# Altium project OpenCore_Carrier_Board.PrjPcb (part 2 of 2)

## Sheet S08_DisplayPort.SchDoc: DisplayPort
size 381 x 241 mm; SheetNumber: 8; SheetTotal: 12
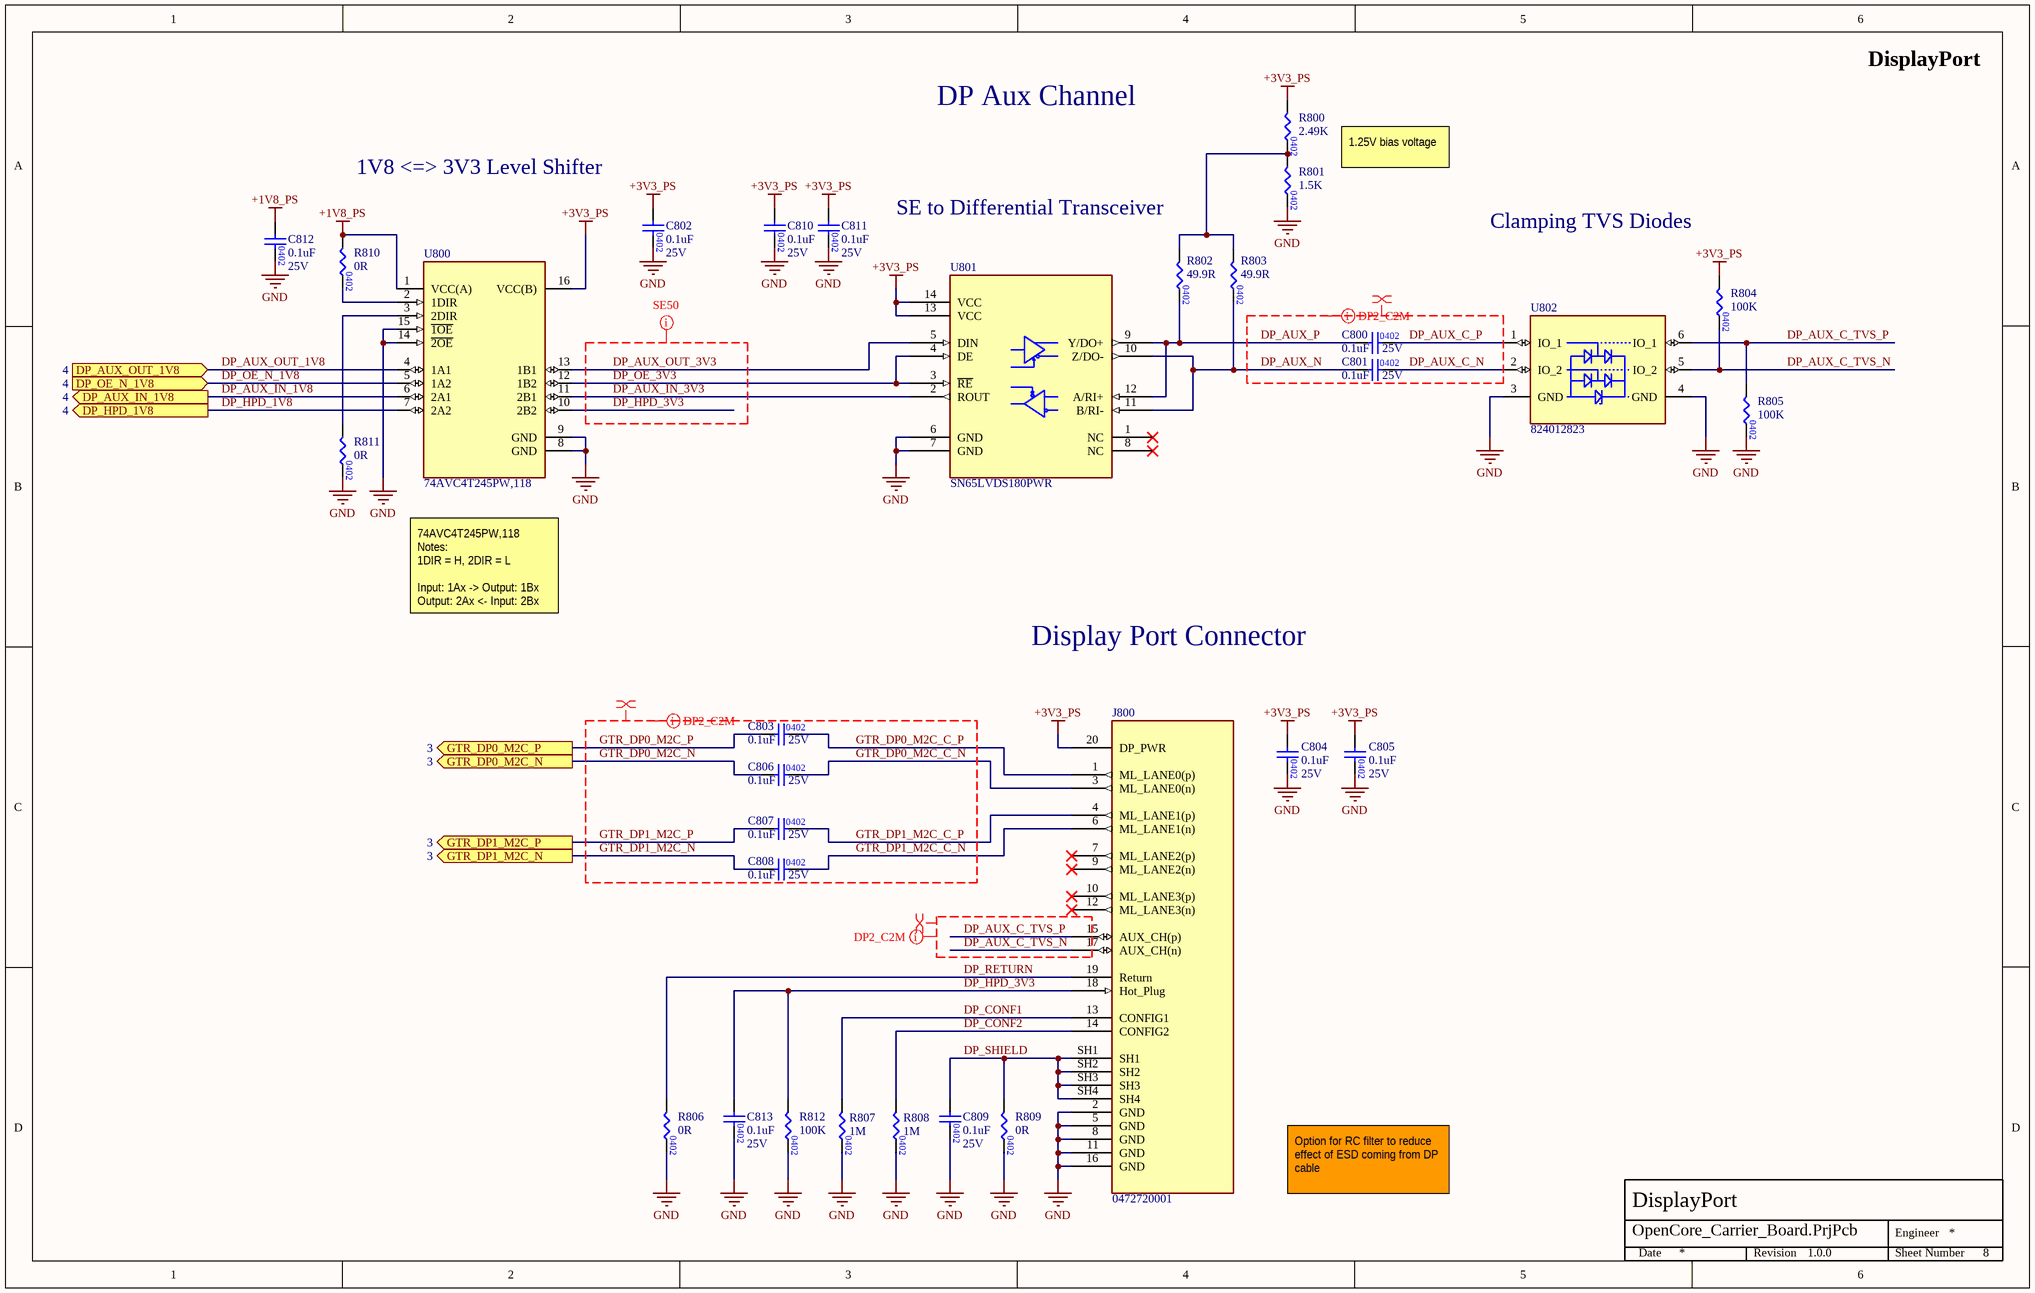
[diagram p7: S08_DisplayPort.SchDoc]

### Parts
C800  value 0.1uF  Voltage Rating: 25V  [CAP0402]  (hidden comment: CAP_0402)
C801  value 0.1uF  Voltage Rating: 25V  [CAP0402]  (hidden comment: CAP_0402)
C802  value 0.1uF  Voltage Rating: 25V  [CAP0402]  (hidden comment: CAP_0402)
C803  value 0.1uF  Voltage Rating: 25V  [CAP0402]  (hidden comment: CAP_0402)
C804  value 0.1uF  Voltage Rating: 25V  [CAP0402]  (hidden comment: CAP_0402)
C805  value 0.1uF  Voltage Rating: 25V  [CAP0402]  (hidden comment: CAP_0402)
C806  value 0.1uF  Voltage Rating: 25V  [CAP0402]  (hidden comment: CAP_0402)
C807  value 0.1uF  Voltage Rating: 25V  [CAP0402]  (hidden comment: CAP_0402)
C808  value 0.1uF  Voltage Rating: 25V  [CAP0402]  (hidden comment: CAP_0402)
C809  value 0.1uF  Voltage Rating: 25V  [CAP0402]  (hidden comment: CAP_0402)
C810  value 0.1uF  Voltage Rating: 25V  [CAP0402]  (hidden comment: CAP_0402)
C811  value 0.1uF  Voltage Rating: 25V  [CAP0402]  (hidden comment: CAP_0402)
C812  value 0.1uF  Voltage Rating: 25V  [CAP0402]  (hidden comment: CAP_0402)
C813  value 0.1uF  Voltage Rating: 25V  [CAP0402]  (hidden comment: CAP_0402)
J800  0472720001  [0472720001]
R800  Resistance: 2.49K  [RES0402]  (hidden comment: RES_0402)
R801  Resistance: 1.5K  [RES0402]  (hidden comment: RES_0402)
R802  Resistance: 49.9R  [RES0402]  (hidden comment: RES_0402)
R803  Resistance: 49.9R  [RES0402]  (hidden comment: RES_0402)
R804  Resistance: 100K  [RES0402]  (hidden comment: RES_0402)
R805  Resistance: 100K  [RES0402]  (hidden comment: RES_0402)
R806  Resistance: 0R  [RES0402]  (hidden comment: RES_0402)
R807  Resistance: 1M  [RES0402]  (hidden comment: RES_0402)
R808  Resistance: 1M  [RES0402]  (hidden comment: RES_0402)
R809  Resistance: 0R  [RES0402]  (hidden comment: RES_0402)
R810  Resistance: 0R  [RES0402]  (hidden comment: RES_0402)
R811  Resistance: 0R  [RES0402]  (hidden comment: RES_0402)
R812  Resistance: 100K  [RES0402]  (hidden comment: RES_0402)
U800  74AVC4T245PW,118  [SOP65P640X110-16N]
U801  SN65LVDS180PWR  [TI_TSSOP14_PW]
U802  824012823  [824012823]

### Ports
DP_AUX_IN_1V8 (out, see 4), DP_AUX_OUT_1V8 (in, see 4), DP_HPD_1V8 (out, see 4), DP_OE_N_1V8 (in, see 4), GTR_DP0_M2C_N (out, see 3), GTR_DP0_M2C_P (out, see 3), GTR_DP1_M2C_N (out, see 3), GTR_DP1_M2C_P (out, see 3)

### Nets
+1V8_PS: C812.1 R810.1 U800.1(VCC(A))
+3V3_PS: C802.1 C804.1 C805.1 C810.1 C811.1 J800.20(DP_PWR) R800.1 R804.1 U800.16(VCC(B)) U801.13(VCC) U801.14(VCC)
GND: C802.2 C804.2 C805.2 C809.2 C810.2 C811.2 C812.2 C813.2 J800.2(GND) J800.5(GND) J800.8(GND) J800.11(GND) J800.16(GND) R801.2 R805.2 R806.2 R807.2 R808.2 R809.2 R811.2 R812.2 U800.8(GND) U800.9(GND) U800.14(~{2OE}) U800.15(~{1OE}) U801.6(GND) U801.7(GND) U802.3(GND) U802.4(GND)
DP_AUX_C_N: C801.2 U802.2(IO_2)
DP_AUX_C_P: C800.2 U802.1(IO_1)
DP_AUX_C_TVS_N: J800.17(AUX_CH(n)) R804.2 U802.5(IO_2)
DP_AUX_C_TVS_P: J800.15(AUX_CH(p)) R805.1 U802.6(IO_1)
DP_AUX_IN_1V8: U800.6(2A1) ; port DP_AUX_IN_1V8
DP_AUX_IN_3V3: U800.11(2B1) U801.2(ROUT)
DP_AUX_N: C801.1 R803.2 U801.10(Z/DO-) U801.11(B/RI-)
DP_AUX_OUT_1V8: U800.4(1A1) ; port DP_AUX_OUT_1V8
DP_AUX_OUT_3V3: U800.13(1B1) U801.5(DIN)
DP_AUX_P: C800.1 R802.2 U801.9(Y/DO+) U801.12(A/RI+)
DP_CONF1: J800.13(CONFIG1) R807.1
DP_CONF2: J800.14(CONFIG2) R808.1
DP_HPD_1V8: U800.7(2A2) ; port DP_HPD_1V8
DP_HPD_3V3: C813.1 J800.18(Hot_Plug) R812.1 U800.10(2B2)
DP_OE_3V3: U800.12(1B2) U801.3(~{RE}) U801.4(DE)
DP_OE_N_1V8: U800.5(1A2) ; port DP_OE_N_1V8
DP_RETURN: J800.19(Return) R806.1
DP_SHIELD: C809.1 J800.SH1 J800.SH2 J800.SH3 J800.SH4 R809.1
GTR_DP0_M2C_C_N: C806.2 J800.3(ML_LANE0(n))
GTR_DP0_M2C_C_P: C803.2 J800.1(ML_LANE0(p))
GTR_DP0_M2C_N: C806.1 ; port GTR_DP0_M2C_N
GTR_DP0_M2C_P: C803.1 ; port GTR_DP0_M2C_P
GTR_DP1_M2C_C_N: C808.2 J800.6(ML_LANE1(n))
GTR_DP1_M2C_C_P: C807.2 J800.4(ML_LANE1(p))
GTR_DP1_M2C_N: C808.1 ; port GTR_DP1_M2C_N
GTR_DP1_M2C_P: C807.1 ; port GTR_DP1_M2C_P
NetR800_2: R800.2 R801.1 R802.1 R803.1
NetR810_2: R810.2 U800.2(1DIR)
NetR811_1: R811.1 U800.3(2DIR)

Not connected (* = marked no-connect by the designer): J800 7(ML_LANE2(p))* 9(ML_LANE2(n))* 10(ML_LANE3(p))* 12(ML_LANE3(n))*; U801 1(NC)* 8(NC)*

### Layout directives
differential pair; differential pair class DIFFPAIR90: DP_AUX_C_N, DP_AUX_C_P, DP_AUX_C_TVS_N, DP_AUX_C_TVS_P, DP_AUX_N, DP_AUX_P, GTR_DP0_M2C_C_N, GTR_DP0_M2C_C_P, GTR_DP0_M2C_N, GTR_DP0_M2C_P, GTR_DP1_M2C_C_N, GTR_DP1_M2C_C_P, GTR_DP1_M2C_N, GTR_DP1_M2C_P
net class DIFFPAIR_DP: DP_AUX_C_N, DP_AUX_C_P, DP_AUX_C_TVS_N, DP_AUX_C_TVS_P, DP_AUX_N, DP_AUX_P, GTR_DP0_M2C_C_N, GTR_DP0_M2C_C_P, GTR_DP0_M2C_N, GTR_DP0_M2C_P, GTR_DP1_M2C_C_N, GTR_DP1_M2C_C_P, GTR_DP1_M2C_N, GTR_DP1_M2C_P
net class SE50: DP_AUX_IN_3V3, DP_AUX_OUT_3V3, DP_HPD_3V3, DP_OE_3V3

### Notes on the sheet
- DP Aux Channel
- 1.25V bias voltage
- 1V8 <=> 3V3 Level Shifter
- SE to Differential Transceiver
- Clamping TVS Diodes
- 74AVC4T245PW,118 Notes:
  1DIR = H, 2DIR = L
  Input: 1Ax -> Output: 1Bx
  Output: 2Ax <- Input: 2Bx
- Display Port Connector
- Option for RC filter to reduce effect of ESD coming from DP cable
- Engineer
- Date
- Revision
- Sheet Number

### Library data of the parts
C800-C813 = CAP_CL05A104KA5NNNC: as C200 on sheet S02_Power_Converters; Manufacturer Part Number 1: CL05A104KA5NNNC; Case/Package: 0402; Mounting Type: Surface Mount; Temperature Coefficient: X5R
J800 = 0472720001: CONN RCPT DISPLAYPORT 20P SMD RA; Manufacturer_Name: Molex; Datasheet Link: http://www.molex.com/pdm_docs/sd/472720001_sd.pdf; Height: 6.9mm; Manufacturer_Part_Number: 0472720001; Mouser Part Number: N/A; Mouser Price/Stock: https://www.mouser.co.uk/ProductDetail/Molex/0472720001?qs=PBcRNPEHKsrarbeLf7n8sg%3D%3D; Arrow Part Number: 0472720001; Arrow Price/Stock: https://www.arrow.com/en/products/0472720001/molex?region=europe
R800 = .RES_RC0402FR-072K49L: RES 2.49K OHM 1% 1/16W 0402; Manufacturer: YAGEO; Manufacturer Part Number: RC0402FR-072K49L; Case/Package: 0402; Tolerance: 1%
R801 = .RES_RC0402FR-071K5L: RES 1.5K OHM 1% 1/16W 0402; Manufacturer: YAGEO; Manufacturer Part Number: RC0402FR-071K5L; Case/Package: 0402; Tolerance: 1%
R802 R803 = .RES_RC0402FR-0749R9L: RES 49.9 OHM 1% 1/16W 0402; Manufacturer: YAGEO; Manufacturer Part Number: RC0402FR-0749R9L; Case/Package: 0402; Tolerance: 1%
R804 R805 R812 = .RES_RC0402FR-07100KL: RES 100K OHM 1% 1/16W 0402; Manufacturer: YAGEO; Manufacturer Part Number: RC0402FR-07100KL; Case/Package: 0402; Tolerance: 1%
R806 R809-R811 = .RES_RC0402JR-070RL: as R201 on sheet S02_Power_Converters; Manufacturer Part Number: RC0402JR-070RL; Case/Package: 0402
R807 R808 = .RES_RC0402FR-071ML: RES 1M OHM 1% 1/16W 0402; Manufacturer: YAGEO; Manufacturer Part Number: RC0402FR-071ML; Case/Package: 0402; Tolerance: 1%
U800 = 74AVC4T245PW,118: IC TRANSLATION TXRX 3.6V 16TSSOP; Manufacturer_Name: Nexperia; Datasheet Link: https://assets.nexperia.com/documents/data-sheet/74AVC4T245.pdf; Height: 1.1mm; Manufacturer_Part_Number: 74AVC4T245PW,118; Mouser Part Number: 771-74AVC4T245PW118; Mouser Price/Stock: https://www.mouser.co.uk/ProductDetail/Nexperia/74AVC4T245PW118?qs=Lc7Es0%252BIaGKdmOKZhQIwZQ%3D%3D; Arrow Part Number: 74AVC4T245PW,118; Arrow Price/Stock: https://www.arrow.com/en/products/74avc4t245pw118/nexperia?region=nac; Supplier 1: Digi-Key; Supplier Part Number 1: 1727-6573-6-ND
U801 = SN65LVDS180PWR: IC TRANSCEIVER FULL 1/1 14TSSOP; Manufacturer_Name: Texas Instruments; Datasheet Link: https://www.ti.com/lit/ds/symlink/sn65lvds050.pdf; Height: 1.2 mm; Manufacturer_Part_Number: SN65LVDS180PWR
U802 = 824012823: TVS DIODE 3.3VWM 13VC DFN1210-6; Manufacturer_Name: Wurth Elektronik; Voltage Breakdown: 4.5V; Datasheet Link: https://www.we-online.com/catalog/datasheet/824012823.pdf; Height: 0.5mm; Manufacturer_Part_Number: 824012823; Mouser Part Number: 710-824012823; Mouser Price/Stock: https://www.mouser.co.uk/ProductDetail/Wurth-Elektronik/824012823?qs=rrS6PyfT74dPtw7q26tZFg%3D%3D; Supplier 1: Digi-Key; Supplier Part Number: 732-11794-6-ND

## Sheet S09_Connectors.SchDoc: Connectors
size 381 x 241 mm; SheetNumber: 9; SheetTotal: 12
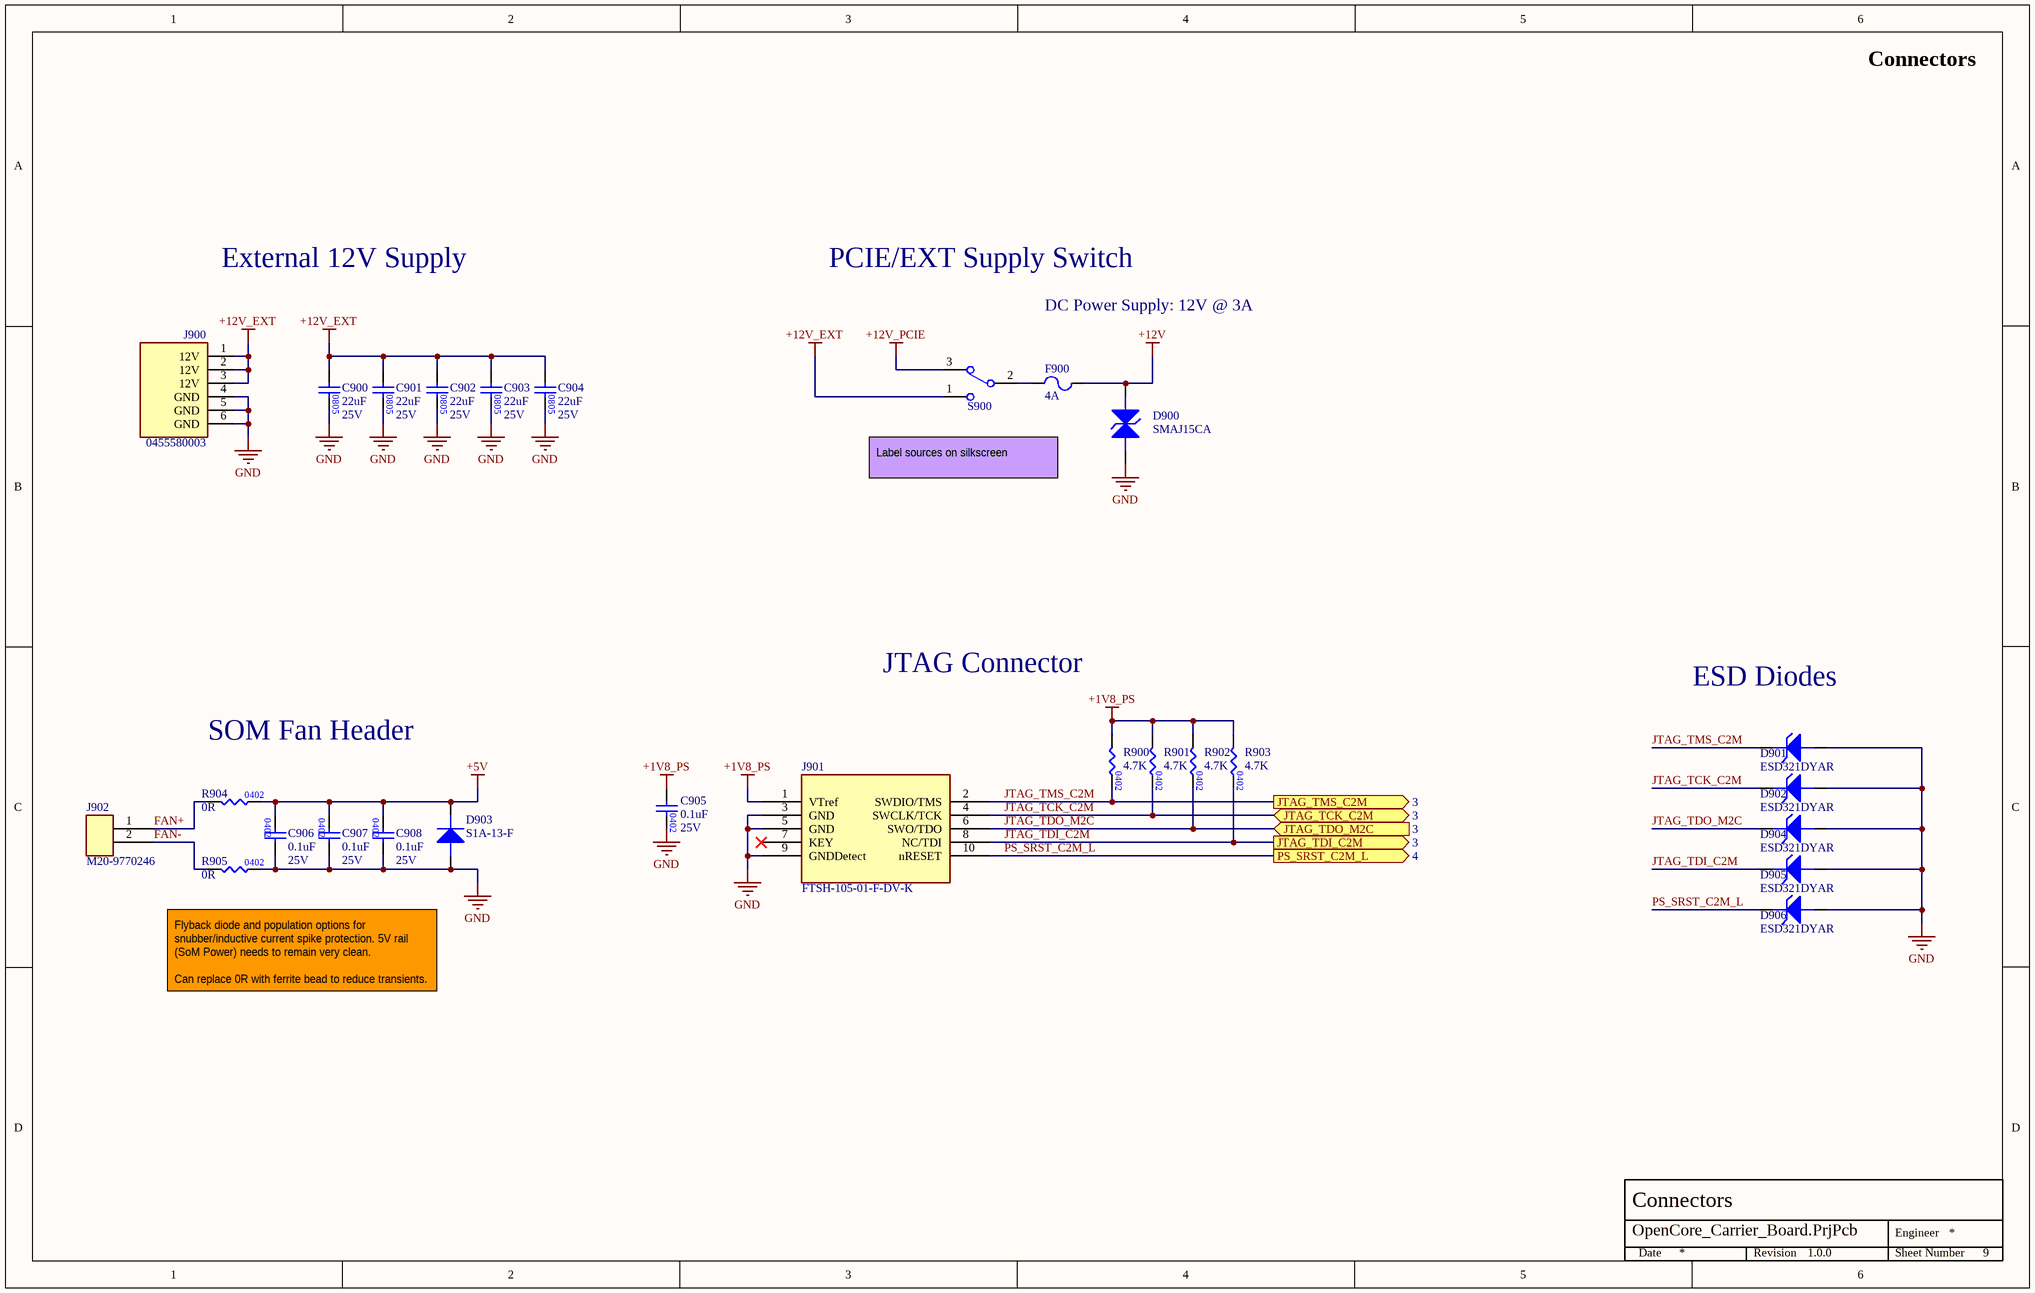
[diagram p8: S09_Connectors.SchDoc]

### Parts
C900  value 22uF  Voltage Rating: 25V  [CAP0805]  (hidden comment: CAP_0805)
C901  value 22uF  Voltage Rating: 25V  [CAP0805]  (hidden comment: CAP_0805)
C902  value 22uF  Voltage Rating: 25V  [CAP0805]  (hidden comment: CAP_0805)
C903  value 22uF  Voltage Rating: 25V  [CAP0805]  (hidden comment: CAP_0805)
C904  value 22uF  Voltage Rating: 25V  [CAP0805]  (hidden comment: CAP_0805)
C905  value 0.1uF  Voltage Rating: 25V  [CAP0402]  (hidden comment: CAP_0402)
C906  value 0.1uF  Voltage Rating: 25V  [CAP0402]  (hidden comment: CAP_0402)
C907  value 0.1uF  Voltage Rating: 25V  [CAP0402]  (hidden comment: CAP_0402)
C908  value 0.1uF  Voltage Rating: 25V  [CAP0402]  (hidden comment: CAP_0402)
D900  TVS DIODE 15VWM 24.4VC DO214AC  [LITTLEFUSE_DO-2014]  (value not drawn)
D901  ESD321DYAR  [TI_SOD523]
D902  ESD321DYAR  [TI_SOD523]
D903  S1A-13-F  [DIODES_SMA]
D904  ESD321DYAR  [TI_SOD523]
D905  ESD321DYAR  [TI_SOD523]
D906  ESD321DYAR  [TI_SOD523]
F900  Current Rating: 4A  [FUSE_0603]  (hidden comment: FUSE_4A_0603)
J900  0455580003  [0455580003]
J901  FTSH-105-01-F-DV-K  [FTSH-105-01-F-DV-K-P-TR]
J902  M20-9770246  [61300211121]
R900  Resistance: 4.7K  [RES0402]  (hidden comment: RES_0402)
R901  Resistance: 4.7K  [RES0402]  (hidden comment: RES_0402)
R902  Resistance: 4.7K  [RES0402]  (hidden comment: RES_0402)
R903  Resistance: 4.7K  [RES0402]  (hidden comment: RES_0402)
R904  Resistance: 0R  [RES0402]  (hidden comment: RES_0402)
R905  Resistance: 0R  [RES0402]  (hidden comment: RES_0402)
S900  SW_SLIDE_TOGGLE  [500SSP1S2M2QEA]  (value not drawn)

### Ports
JTAG_TCK_C2M (bidir, see 3), JTAG_TDI_C2M (out, see 3), JTAG_TDO_M2C (in, see 3), JTAG_TMS_C2M (out, see 3), PS_SRST_C2M_L (out, see 4)

### Nets
+1V8_PS: C905.1 J901.1(VTref) R900.1 R901.1 R902.1 R903.1
+5V: C906.1 C907.1 C908.1 D903.K(Cathode) R904.2
+12V: D900.A(Anode) F900.2
+12V_EXT: C900.1 C901.1 C902.1 C903.1 C904.1 J900.1(12V) J900.2(12V) J900.3(12V) S900.1
+12V_PCIE: S900.3
GND: C900.2 C901.2 C902.2 C903.2 C904.2 C905.2 C906.2 C907.2 C908.2 D900.K(Cathode) D901.A(Anode) D902.A(Anode) D903.A(Anode) D904.A(Anode) D905.A(Anode) D906.A(Anode) J900.4(GND) J900.5(GND) J900.6(GND) J901.3(GND) J901.5(GND) J901.9(GNDDetect) R905.2
FAN+: J902.1 R904.1
FAN-: J902.2 R905.1
JTAG_TCK_C2M: D902.K(Cathode) J901.4(SWCLK/TCK) R901.2 ; port JTAG_TCK_C2M
JTAG_TDI_C2M: D905.K(Cathode) J901.8(NC/TDI) R903.2 ; port JTAG_TDI_C2M
JTAG_TDO_M2C: D904.K(Cathode) J901.6(SWO/TDO) R902.2 ; port JTAG_TDO_M2C
JTAG_TMS_C2M: D901.K(Cathode) J901.2(SWDIO/TMS) R900.2 ; port JTAG_TMS_C2M
PS_SRST_C2M_L: D906.K(Cathode) J901.10(nRESET) ; port PS_SRST_C2M_L
NetF900_1: F900.1 S900.2

Not connected (* = marked no-connect by the designer): J901 7(KEY)*

### Notes on the sheet
- External 12V Supply
- PCIE/EXT Supply Switch
- DC Power Supply: 12V @ 3A
- Label sources on silkscreen
- JTAG Connector
- ESD Diodes
- SOM Fan Header
- Flyback diode and population options for snubber/inductive current spike protection. 5V rail (SoM Power) needs to remain very clean.
  Can replace 0R with ferrite bead to reduce transients.
- Engineer
- Date
- Revision
- Sheet Number

### Library data of the parts
C900-C904 = CAP_CL21A226MAYNNNE: CAP CER 22UF 25V X5R 0805; Manufacturer: Samsung Electro-Mechanics; Tolerance: 20%; Manufacturer Part Number 1: CL21A226MAYNNNE; Case/Package: 0805; Mounting Type: Surface Mount; Temperature Coefficient: X5R
C905-C908 = CAP_CL05A104KA5NNNC: as C200 on sheet S02_Power_Converters; Manufacturer Part Number 1: CL05A104KA5NNNC; Case/Package: 0402; Mounting Type: Surface Mount; Temperature Coefficient: X5R
D900 = SMAJ15CA: 24.4V Clamp 16.4A Ipp Tvs Diode Surface Mount DO-214AC (SMA); Manufacturer Part Number: SMAJ15CA
D901 D902 D904-D906 = ESD321DYAR: TVS DIODE 3.6VWM 6.3VC SOT5X3; Manfacturer Part Number: ESD321DYAR
D903 = S1A-13-F: Diode 50 V 1A Surface Mount SMA; Reverse Voltage: 50V; Forward Voltage: 1.1V; Manufacturer Part Number: S1A-13-F; Current Rating: 1A
F900 = FUSE_4A_0603: FUSE SMD 4A 32V; Manufacturer 1: Vishay; Manufacturer Part Number 1: MFU0603FF04000P500; Package/Footprint: 0603; Voltage Rating (DC): 32V; Supplier 1: Digi-Key; Mounting Type: SMD; Supplier Part Number 1: 749-MFU0603FF04000P500DKR-ND
J900 = 0455580003: Connector Header Through Hole, Right Angle 6 position 0.165" (4.20mm); Manufacturer_Name: Molex; Datasheet Link: http://www.molex.com/pdm_docs/sd/455580003_sd.pdf; Height: 10mm; Manufacturer_Part_Number: 0455580003; Mouser Part Number: N/A; Mouser Price/Stock: https://www.mouser.co.uk/ProductDetail/Molex/0455580003?qs=PBcRNPEHKsr%252BGoTfgbyscA%3D%3D; Arrow Part Number: 0455580003; Arrow Price/Stock: https://www.arrow.com/en/products/0455580003/molex?region=nac
J901 = FTSH-105-01-F-DV-K: CONN HEADER SMD 10POS 1.27MM; Manufacturer: Samtec; Number of Positions: 10; Number of Rows: 2; Manufacturer Part Number 1: FTSH-105-01-F-DV-K
J902 = M20-9770246: CONN HEADER VERT 2POS 2.54MM; Positions: 2; Rows: 1; Manufacturer Part Number: M20-9770246
R900-R903 = .RES_RC0402FR-074K7L: as R305 on sheet S03_SOM1_A_B; Manufacturer Part Number: RC0402FR-074K7L; Case/Package: 0402; Tolerance: 1%
R904 R905 = .RES_RC0402JR-070RL: as R201 on sheet S02_Power_Converters; Manufacturer Part Number: RC0402JR-070RL; Case/Package: 0402
S900 = SW_SLIDE_TOGGLE: SWITCH SLIDE SPDT 5A 28V; Manufacturer 1: E-Switch; Package/Footprint: TH; Supplier 1: Digi-Key; Mounting Type: TH; Voltage Rating (DC): 28V; Throw Configuration: SPDT; Supplier Part Number 1: EG5137-ND; Manufacturer Part Number 1: 500SSP1S2M2QEA

## Sheet S10_Reset_Logic.SchDoc: Reset Logic
size 381 x 241 mm; SheetNumber: 10; SheetTotal: 12
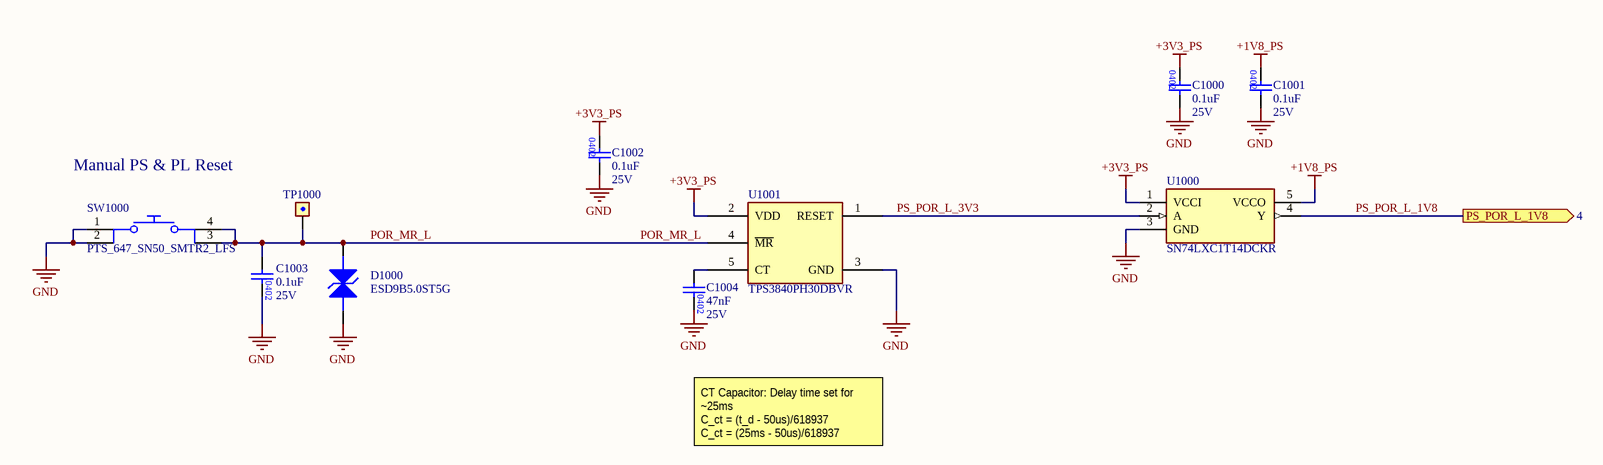
[diagram p9: S10_Reset_Logic.SchDoc]

### Parts
C1000  value 0.1uF  Voltage Rating: 25V  [CAP0402]  (hidden comment: CAP_0402)
C1001  value 0.1uF  Voltage Rating: 25V  [CAP0402]  (hidden comment: CAP_0402)
C1002  value 0.1uF  Voltage Rating: 25V  [CAP0402]  (hidden comment: CAP_0402)
C1003  value 0.1uF  Voltage Rating: 25V  [CAP0402]  (hidden comment: CAP_0402)
C1004  value 47nF  Voltage Rating: 25V  [CAP0402]  (hidden comment: CAP_0402)
D1000  ESD9B5.0ST5G  [ONSEMI_SOD-923]
SW1000  PTS_647_SN50_SMTR2_LFS  [TACTILE_SW_4.5MM]
TP1000  1mm Round Pad Testpoint  [TP_1MM]  (value not drawn)
U1000  SN74LXC1T14DCKR  [TI_SC70_DCK0005A]
U1001  TPS3840PH30DBVR  [TI_SOT23_DBV0005A]

### Ports
PS_POR_L_1V8 (out, see 4)

### Nets
+1V8_PS: C1001.1 U1000.5(VCCO)
+3V3_PS: C1000.1 C1002.1 U1000.1(VCCI) U1001.2(VDD)
GND: C1000.2 C1001.2 C1002.2 C1003.2 C1004.2 D1000.K(Cathode) SW1000.1 SW1000.2 U1000.3(GND) U1001.3(GND)
POR_MR_L: C1003.1 D1000.A(Anode) SW1000.3 SW1000.4 TP1000.1 U1001.4(~{MR})
PS_POR_L_1V8: U1000.4(Y) ; port PS_POR_L_1V8
PS_POR_L_3V3: U1000.2(A) U1001.1(RESET)
NetC1004_1: C1004.1 U1001.5(CT)

### Notes on the sheet
- Manual PS & PL Reset
- CT Capacitor: Delay time set for ~25ms
  C_ct = (t_d - 50us)/618937
  C_ct = (25ms - 50us)/618937
  C_ct = 40.3nF
- Engineer
- Date
- Revision
- Sheet Number

### Library data of the parts
C1000-C1003 = CAP_CL05A104KA5NNNC: CAP CER 0.1UF 25V X5R 0402; Manufacturer: Samsung Electro-Mechanics; Tolerance: 10%; Manufacturer Part Number 1: CL05A104KA5NNNC; Case/Package: 0402; Mounting Type: Surface Mount; Temperature Coefficient: X5R
C1004 = CAP_GRM155R71E473KA88D: CAP CER 0.047UF 25V X7R 0402; Manufacturer: Murata Electronics; Tolerance: 10%; Manufacturer Part Number 1: GRM155R71E473KA88D; Case/Package: 0402; Mounting Type: Surface Mount; Temperature Coefficient: X7R
D1000 = ESD9B5.0ST5G: TVS DIODE 5VWM SOD923; Manufacturer Part Number: ESD9B5.0ST5G
SW1000 = PTS_647_SN50_SMTR2_LFS: SWITCH TACTILE SPST-NO 0.05A 12V
TP1000 = TP_1MM
U1000 = SN74LXC1T14DCKR: IC TRANSLATOR UNIDIR SC70-5
U1001 = TPS3840PH30DBVR: IC SUPERVISOR 1 CHANNEL SOT23-5

## Sheet S11_LEDs.SchDoc: LEDs
size 381 x 241 mm; SheetNumber: 11; SheetTotal: 12
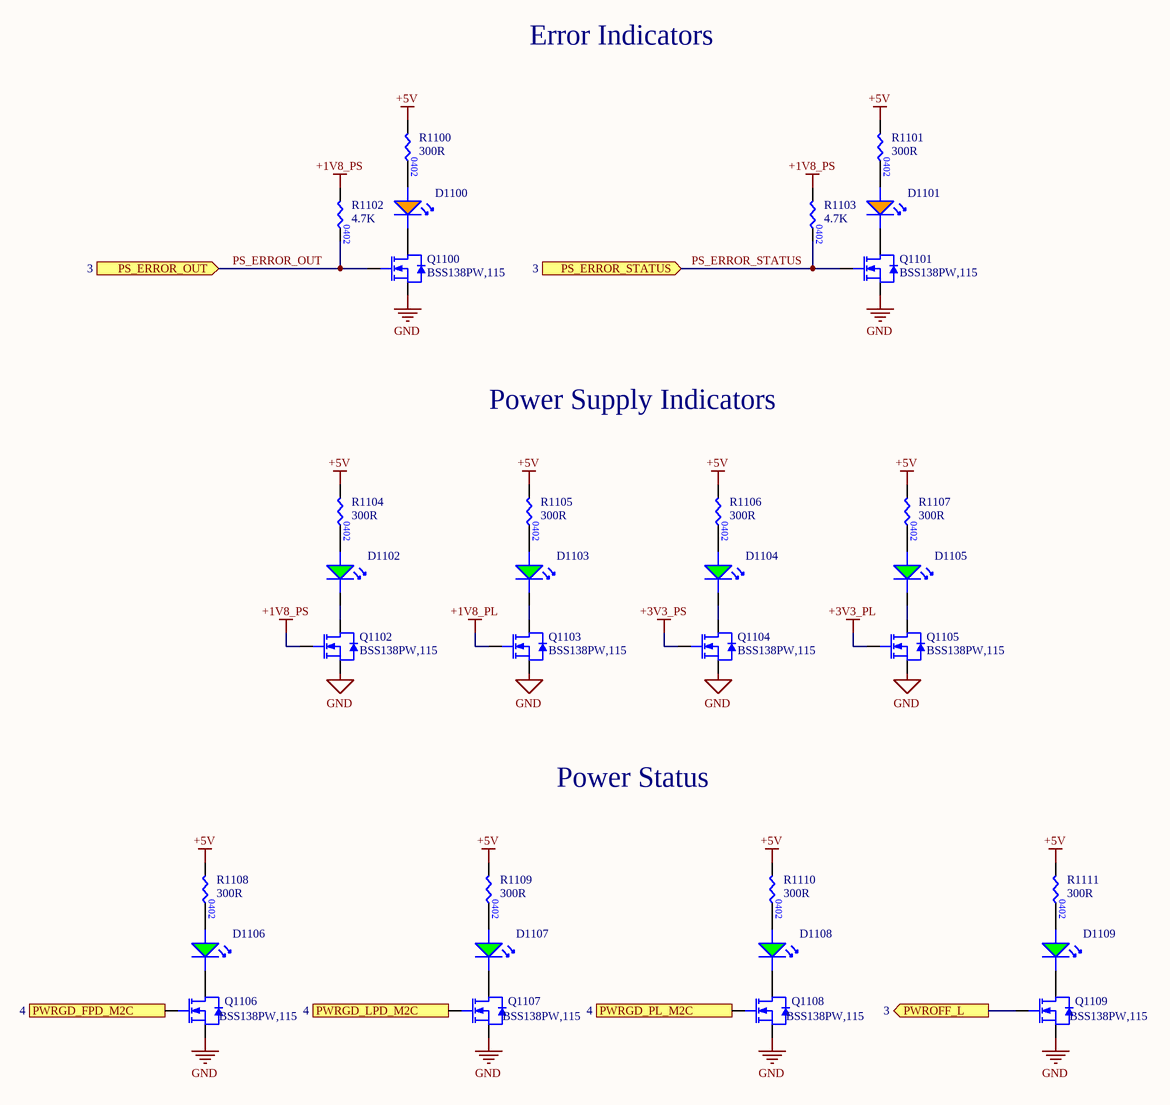
[diagram p10: S11_LEDs.SchDoc]

### Parts
D1100  GENERIC LED - ORANGE  [LED_0603]  (value not drawn)
D1101  GENERIC LED - ORANGE  [LED_0603]  (value not drawn)
D1102  GENERIC LED - GREEN  [LED_0603]  (value not drawn)
D1103  GENERIC LED - GREEN  [LED_0603]  (value not drawn)
D1104  GENERIC LED - GREEN  [LED_0603]  (value not drawn)
D1105  GENERIC LED - GREEN  [LED_0603]  (value not drawn)
D1106  GENERIC LED - GREEN  [LED_0603]  (value not drawn)
D1107  GENERIC LED - GREEN  [LED_0603]  (value not drawn)
D1108  GENERIC LED - GREEN  [LED_0603]  (value not drawn)
D1109  GENERIC LED - GREEN  [LED_0603]  (value not drawn)
Q1100  BSS138PW,115  [NEXPERIA_SOT323]
Q1101  BSS138PW,115  [NEXPERIA_SOT323]
Q1102  BSS138PW,115  [NEXPERIA_SOT323]
Q1103  BSS138PW,115  [NEXPERIA_SOT323]
Q1104  BSS138PW,115  [NEXPERIA_SOT323]
Q1105  BSS138PW,115  [NEXPERIA_SOT323]
Q1106  BSS138PW,115  [NEXPERIA_SOT323]
Q1107  BSS138PW,115  [NEXPERIA_SOT323]
Q1108  BSS138PW,115  [NEXPERIA_SOT323]
Q1109  BSS138PW,115  [NEXPERIA_SOT323]
R1100  Resistance: 300R  [RES0402]  (hidden comment: RES_0402)
R1101  Resistance: 300R  [RES0402]  (hidden comment: RES_0402)
R1102  Resistance: 4.7K  [RES0402]  (hidden comment: RES_0402)
R1103  Resistance: 4.7K  [RES0402]  (hidden comment: RES_0402)
R1104  Resistance: 300R  [RES0402]  (hidden comment: RES_0402)
R1105  Resistance: 300R  [RES0402]  (hidden comment: RES_0402)
R1106  Resistance: 300R  [RES0402]  (hidden comment: RES_0402)
R1107  Resistance: 300R  [RES0402]  (hidden comment: RES_0402)
R1108  Resistance: 300R  [RES0402]  (hidden comment: RES_0402)
R1109  Resistance: 300R  [RES0402]  (hidden comment: RES_0402)
R1110  Resistance: 300R  [RES0402]  (hidden comment: RES_0402)
R1111  Resistance: 300R  [RES0402]  (hidden comment: RES_0402)

### Ports
PS_ERROR_OUT (in, see 3), PS_ERROR_STATUS (in, see 3), PWRGD_FPD_M2C (out, see 4), PWRGD_LPD_M2C (out, see 4), PWRGD_PL_M2C (out, see 4), PWROFF_L (out, see 3)

### Nets
+1V8_PL: Q1103.1(Gate)
+1V8_PS: Q1102.1(Gate) R1102.1 R1103.1
+3V3_PL: Q1105.1(Gate)
+3V3_PS: Q1104.1(Gate)
+5V: R1100.1 R1101.1 R1104.1 R1105.1 R1106.1 R1107.1 R1108.1 R1109.1 R1110.1 R1111.1
GND: Q1100.2(Source) Q1101.2(Source) Q1102.2(Source) Q1103.2(Source) Q1104.2(Source) Q1105.2(Source) Q1106.2(Source) Q1107.2(Source) Q1108.2(Source) Q1109.2(Source)
PS_ERROR_OUT: Q1100.1(Gate) R1102.2 ; port PS_ERROR_OUT
PS_ERROR_STATUS: Q1101.1(Gate) R1103.2 ; port PS_ERROR_STATUS
PWROFF_L: Q1109.1(Gate) ; port PWROFF_L
NetD1100_A: D1100.A(Anode) R1100.2
NetD1100_K: D1100.K(Cathode) Q1100.3(Drain)
NetD1101_A: D1101.A(Anode) R1101.2
NetD1101_K: D1101.K(Cathode) Q1101.3(Drain)
NetD1102_A: D1102.A(Anode) R1104.2
NetD1102_K: D1102.K(Cathode) Q1102.3(Drain)
NetD1103_A: D1103.A(Anode) R1105.2
NetD1103_K: D1103.K(Cathode) Q1103.3(Drain)
NetD1104_A: D1104.A(Anode) R1106.2
NetD1104_K: D1104.K(Cathode) Q1104.3(Drain)
NetD1105_A: D1105.A(Anode) R1107.2
NetD1105_K: D1105.K(Cathode) Q1105.3(Drain)
NetD1106_A: D1106.A(Anode) R1108.2
NetD1106_K: D1106.K(Cathode) Q1106.3(Drain)
NetD1107_A: D1107.A(Anode) R1109.2
NetD1107_K: D1107.K(Cathode) Q1107.3(Drain)
NetD1108_A: D1108.A(Anode) R1110.2
NetD1108_K: D1108.K(Cathode) Q1108.3(Drain)
NetD1109_A: D1109.A(Anode) R1111.2
NetD1109_K: D1109.K(Cathode) Q1109.3(Drain)
NetJ300_S1_D24: Q1106.1(Gate) ; port PWRGD_FPD_M2C
NetJ300_S1_D25: Q1107.1(Gate) ; port PWRGD_LPD_M2C
NetJ300_S1_D26: Q1108.1(Gate) ; port PWRGD_PL_M2C

### Notes on the sheet
- Error Indicators
- Power Supply Indicators
- Power Status
- Engineer
- Date
- Revision
- Sheet Number

### Library data of the parts
D1100 D1101 = .LED_ORANGE: Manufacturer Part Number: 150060AS75000
D1102-D1109 = .LED_GREEN: Manufacturer Part Number: 150060VS75000
Q1100-Q1109 = BSS138PW,115: MOSFET N-CH 60V 320MA SOT323
R1100 R1101 R1104-R1111 = .RES_RC0402FR-07300RL: RES 300 OHM 1% 1/16W 0402; Manufacturer: YAGEO; Manufacturer Part Number: RC0402FR-07300RL; Case/Package: 0402; Tolerance: 1%
R1102 R1103 = .RES_RC0402FR-074K7L: RES 4.7K OHM 1% 1/16W 0402; Manufacturer: YAGEO; Manufacturer Part Number: RC0402FR-074K7L; Case/Package: 0402; Tolerance: 1%

## Sheet S12_Clocks.SchDoc
size 381 x 241 mm; SheetNumber: 12; SheetTotal: 12
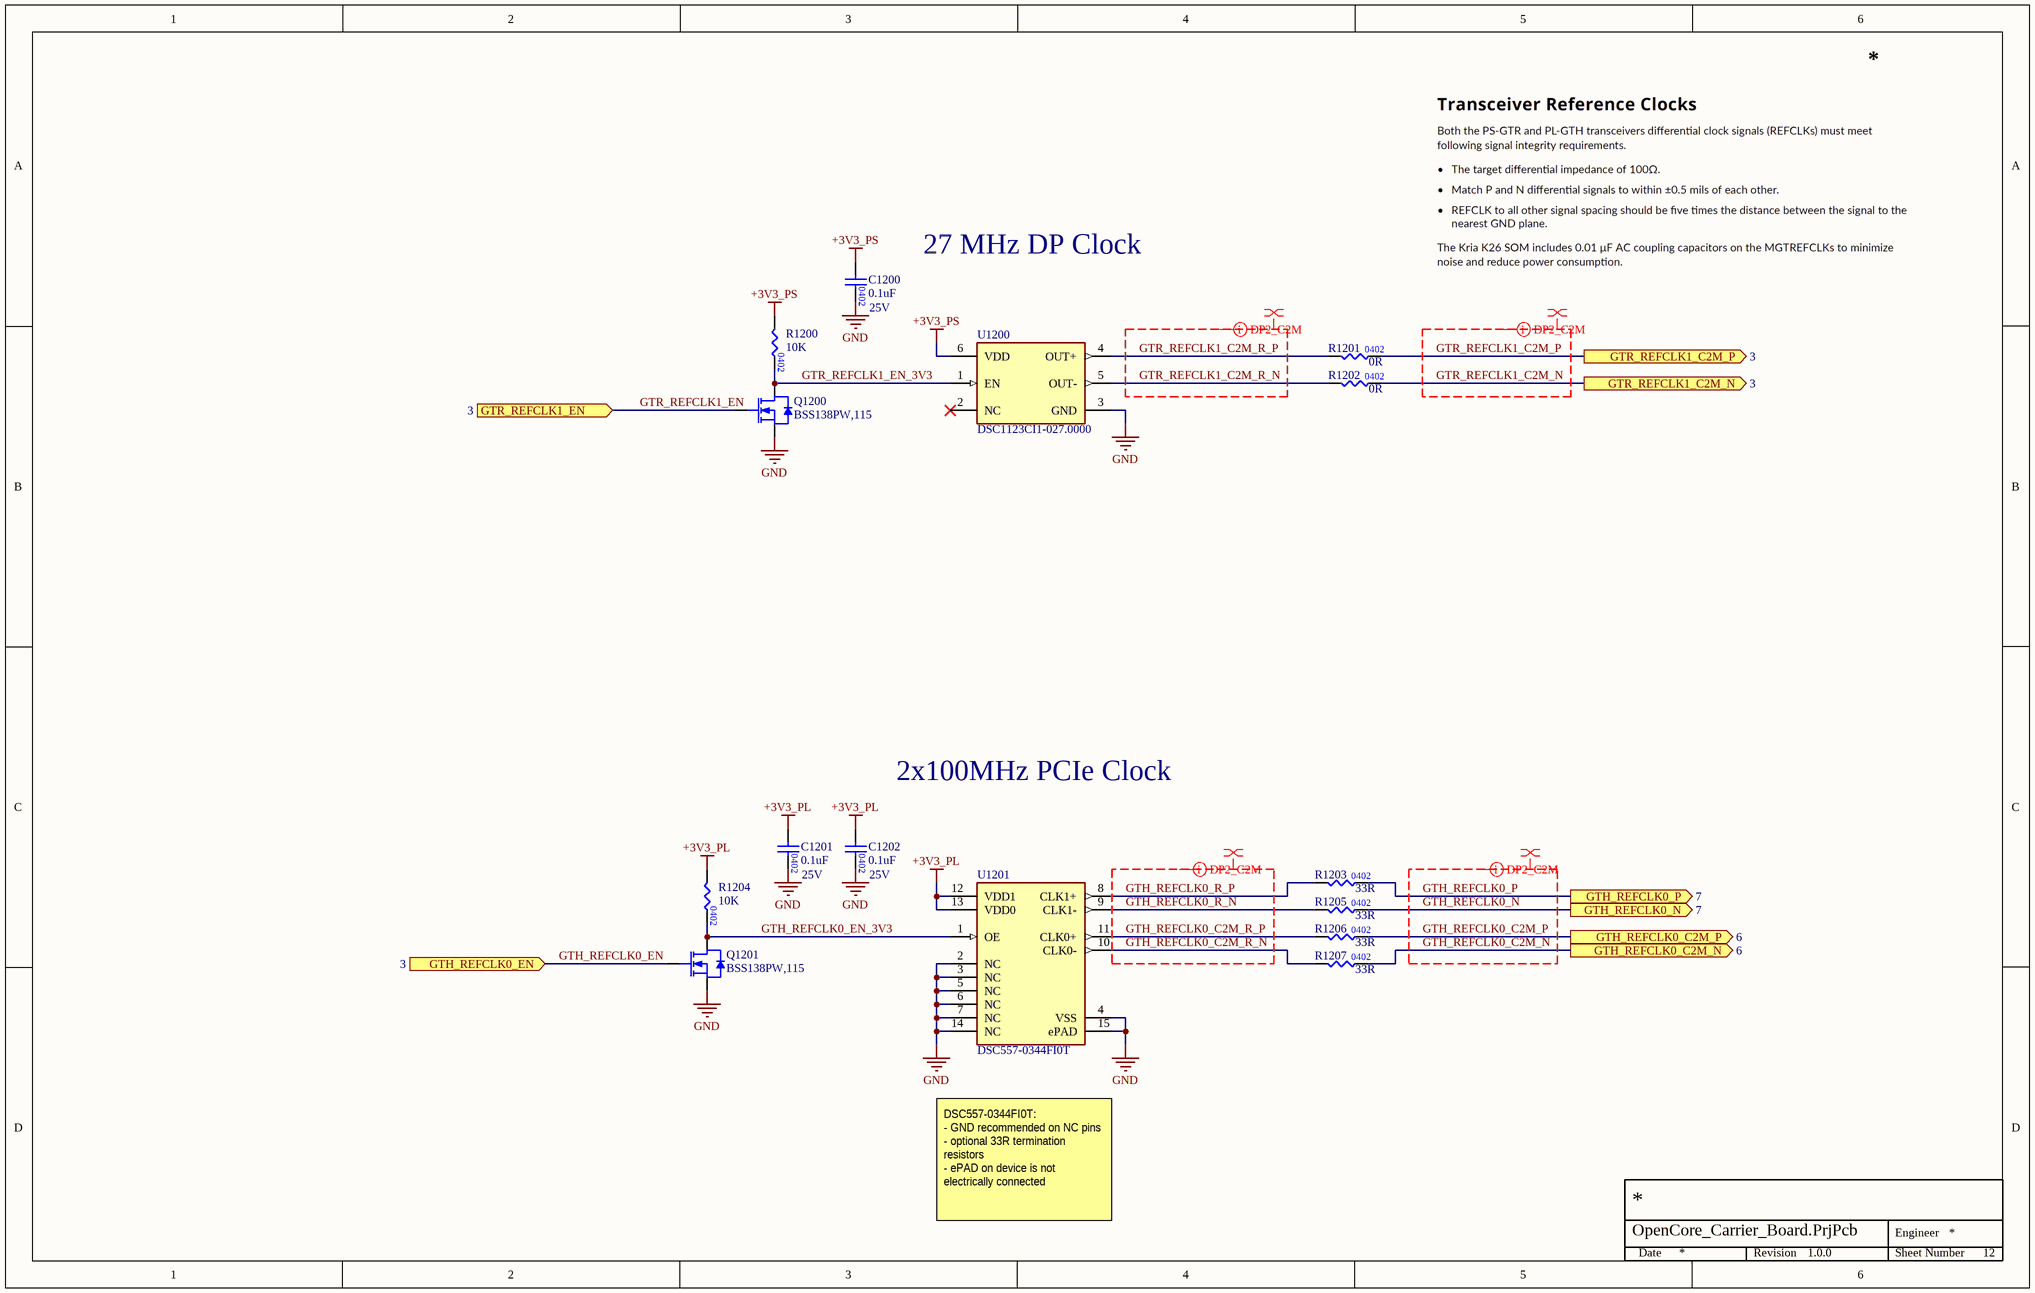
[diagram p11: S12_Clocks.SchDoc]

### Parts
C1200  value 0.1uF  Voltage Rating: 25V  [CAP0402]  (hidden comment: CAP_0402)
C1201  value 0.1uF  Voltage Rating: 25V  [CAP0402]  (hidden comment: CAP_0402)
C1202  value 0.1uF  Voltage Rating: 25V  [CAP0402]  (hidden comment: CAP_0402)
Q1200  BSS138PW,115  [NEXPERIA_SOT323]
Q1201  BSS138PW,115  [NEXPERIA_SOT323]
R1200  Resistance: 10K  [RES0402]  (hidden comment: RES_0402)
R1201  Resistance: 0R  [RES0402]  (hidden comment: RES_0402)
R1202  Resistance: 0R  [RES0402]  (hidden comment: RES_0402)
R1203  Resistance: 33R  [RES0402]  (hidden comment: RES_0402)
R1204  Resistance: 10K  [RES0402]  (hidden comment: RES_0402)
R1205  Resistance: 33R  [RES0402]  (hidden comment: RES_0402)
R1206  Resistance: 33R  [RES0402]  (hidden comment: RES_0402)
R1207  Resistance: 33R  [RES0402]  (hidden comment: RES_0402)
U1200  DSC1123CI1-027.0000  [MICROCHIP_VDFN-6_H5A]
U1201  DSC557-0344FI0T  [MICROCHIP_QFN2532-14]

### Ports
GTH_REFCLK0_C2M_N (out, see 6), GTH_REFCLK0_C2M_P (out, see 6), GTH_REFCLK0_EN (in, see 3), GTH_REFCLK0_N (out, see 7), GTH_REFCLK0_P (out, see 7), GTR_REFCLK1_C2M_N (out, see 3), GTR_REFCLK1_C2M_P (out, see 3), GTR_REFCLK1_EN (in, see 3)

### Nets
+3V3_PL: C1201.1 C1202.1 R1204.1 U1201.12(VDD1) U1201.13(VDD0)
+3V3_PS: C1200.1 R1200.1 U1200.6(VDD)
GND: C1200.2 C1201.2 C1202.2 Q1200.2(Source) Q1201.2(Source) U1200.3(GND) U1201.2(NC) U1201.3(NC) U1201.4(VSS) U1201.5(NC) U1201.6(NC) U1201.7(NC) U1201.14(NC) U1201.15(ePAD)
GTH_REFCLK0_C2M_N: R1207.2 ; port GTH_REFCLK0_C2M_N
GTH_REFCLK0_C2M_P: R1206.2 ; port GTH_REFCLK0_C2M_P
GTH_REFCLK0_C2M_R_N: R1207.1 U1201.10(CLK0-)
GTH_REFCLK0_C2M_R_P: R1206.1 U1201.11(CLK0+)
GTH_REFCLK0_EN: Q1201.1(Gate) ; port GTH_REFCLK0_EN
GTH_REFCLK0_EN_3V3: Q1201.3(Drain) R1204.2 U1201.1(OE)
GTH_REFCLK0_N: R1205.2 ; port GTH_REFCLK0_N
GTH_REFCLK0_P: R1203.2 ; port GTH_REFCLK0_P
GTH_REFCLK0_R_N: R1205.1 U1201.9(CLK1-)
GTH_REFCLK0_R_P: R1203.1 U1201.8(CLK1+)
GTR_REFCLK1_C2M_N: R1202.2 ; port GTR_REFCLK1_C2M_N
GTR_REFCLK1_C2M_P: R1201.2 ; port GTR_REFCLK1_C2M_P
GTR_REFCLK1_C2M_R_N: R1202.1 U1200.5(OUT-)
GTR_REFCLK1_C2M_R_P: R1201.1 U1200.4(OUT+)
GTR_REFCLK1_EN: Q1200.1(Gate) ; port GTR_REFCLK1_EN
GTR_REFCLK1_EN_3V3: Q1200.3(Drain) R1200.2 U1200.1(EN)

Not connected (* = marked no-connect by the designer): U1200 2(NC)*

### Layout directives
differential pair; differential pair class DIFFPAIR100: GTH_REFCLK0_C2M_N, GTH_REFCLK0_C2M_P, GTH_REFCLK0_C2M_R_N, GTH_REFCLK0_C2M_R_P, GTH_REFCLK0_N, GTH_REFCLK0_P, GTH_REFCLK0_R_N, GTH_REFCLK0_R_P, GTR_REFCLK1_C2M_N, GTR_REFCLK1_C2M_P, GTR_REFCLK1_C2M_R_N, GTR_REFCLK1_C2M_R_P
net class DIFFPAIR_REFCLK: GTH_REFCLK0_C2M_N, GTH_REFCLK0_C2M_P, GTH_REFCLK0_C2M_R_N, GTH_REFCLK0_C2M_R_P, GTH_REFCLK0_N, GTH_REFCLK0_P, GTH_REFCLK0_R_N, GTH_REFCLK0_R_P, GTR_REFCLK1_C2M_N, GTR_REFCLK1_C2M_P, GTR_REFCLK1_C2M_R_N, GTR_REFCLK1_C2M_R_P

### Notes on the sheet
- 27 MHz DP Clock
- 2x100MHz PCIe Clock
- DSC557-0344FI0T:
  - GND recommended on NC pins
  - optional 33R termination resistors
  - ePAD on device is not electrically connected
- Engineer
- Date
- Revision
- Sheet Number

### Library data of the parts
C1200-C1202 = CAP_CL05A104KA5NNNC: as C1000-C1003 on sheet S10_Reset_Logic; Manufacturer Part Number 1: CL05A104KA5NNNC; Case/Package: 0402; Mounting Type: Surface Mount; Temperature Coefficient: X5R
Q1200 Q1201 = BSS138PW,115: MOSFET N-CH 60V 320MA SOT323
R1200 R1204 = .RES_RC0402FR-0710KL: RES 10K OHM 1% 1/16W 0402; Manufacturer: YAGEO; Manufacturer Part Number: RC0402FR-0710KL; Case/Package: 0402; Tolerance: 1%
R1201 R1202 = .RES_RC0402JR-070RL: RES 0 OHM JUMPER 1/16W 0402; Manufacturer: YAGEO; Tolerance: 1%; Manufacturer Part Number: RC0402JR-070RL; Case/Package: 0402
R1203 R1205-R1207 = .RES_RC0402FR-0733RL: RES 33 OHM 1% 1/16W 0402; Manufacturer: YAGEO; Manufacturer Part Number: RC0402FR-0733RL; Case/Package: 0402; Tolerance: 1%
U1200 = DSC1123CI1-027.0000: MEMS OSC XO 27.0000MHZ LVDS SMD
U1201 = DSC557-0344FI0T: IC CLOCK GEN PCIE 14QFN

## Nets that join several sheets
+1V8_PL: S02_Power_Converters (6 pins), S03_SOM1_A_B (C303.1 C304.1 J300.S1_B13 J300.S1_B14), S04_SOM1_C_D (J300.S1_D1 J300.S1_D2), S05_SOM2_A_B (8 pins), S06_SOM2_C_D (6 pins), S07_PCIe_Connector (C700.1 R707.1 U700.1), S11_LEDs (Q1103.1)
+1V8_PS: S02_Power_Converters (6 pins), S04_SOM1_C_D (R400.1 R401.1), S08_DisplayPort (C812.1 R810.1 U800.1), S09_Connectors (6 pins), S10_Reset_Logic (C1001.1 U1000.5), S11_LEDs (Q1102.1 R1102.1 R1103.1)
+3V3_PL: S02_Power_Converters (6 pins), S06_SOM2_C_D (C604.1 C605.1 J300.S2_D59 J300.S2_D60), S11_LEDs (Q1105.1), S12_Clocks (5 pins)
+3V3_PS: S02_Power_Converters (6 pins), S07_PCIe_Connector (R706.2), S08_DisplayPort (11 pins), S10_Reset_Logic (C1000.1 C1002.1 U1000.1 U1001.2), S11_LEDs (Q1104.1), S12_Clocks (C1200.1 R1200.1 U1200.6)
+5V: S02_Power_Converters (19 pins), S03_SOM1_A_B (7 pins), S04_SOM1_C_D (5 pins), S09_Connectors (5 pins), S11_LEDs (10 pins)
+12V: S02_Power_Converters (8 pins), S09_Connectors (D900.A F900.2)
+12V_PCIE: S07_PCIe_Connector (10 pins), S09_Connectors (S900.3)
GND: S02_Power_Converters (48 pins), S03_SOM1_A_B (50 pins), S04_SOM1_C_D (51 pins), S05_SOM2_A_B (44 pins), S06_SOM2_C_D (47 pins), S07_PCIe_Connector (78 pins), S08_DisplayPort (29 pins), S09_Connectors (23 pins), S10_Reset_Logic (10 pins), S11_LEDs (10 pins), S12_Clocks (14 pins)
1V8_PL_PG: S02_Power_Converters (U204.6), S04_SOM1_C_D (J300.S1_D45)
1V8_PS_PG: S02_Power_Converters (U203.6), S04_SOM1_C_D (J300.S1_D44)
3V3_PL_PG: S02_Power_Converters (U202.4), S04_SOM1_C_D (J300.S1_D41)
3V3_PS_PG: S02_Power_Converters (U201.4), S04_SOM1_C_D (J300.S1_D42)
DP_AUX_IN_1V8: S04_SOM1_C_D (J300.S1_C31), S08_DisplayPort (U800.6)
DP_AUX_OUT_1V8: S04_SOM1_C_D (J300.S1_D29), S08_DisplayPort (U800.4)
DP_HPD_1V8: S04_SOM1_C_D (J300.S1_D30), S08_DisplayPort (U800.7)
DP_OE_N_1V8: S04_SOM1_C_D (J300.S1_C30), S08_DisplayPort (U800.5)
EN_PL: S02_Power_Converters (R209.1 R217.1 TP203.1), S03_SOM1_A_B (J300.S1_A20)
EN_PS: S02_Power_Converters (R207.1 R215.1 TP202.1), S03_SOM1_A_B (J300.S1_A19)
GTH_DP0_C2M_N: S05_SOM2_A_B (J300.S2_B10), S07_PCIe_Connector (J700.A17)
GTH_DP0_C2M_P: S05_SOM2_A_B (J300.S2_B9), S07_PCIe_Connector (J700.A16)
GTH_DP0_M2C_N: S06_SOM2_C_D (J300.S2_D10), S07_PCIe_Connector (C703.2)
GTH_DP0_M2C_P: S06_SOM2_C_D (J300.S2_D9), S07_PCIe_Connector (C702.2)
GTH_DP1_C2M_N: S06_SOM2_C_D (J300.S2_D2), S07_PCIe_Connector (J700.A22)
GTH_DP1_C2M_P: S06_SOM2_C_D (J300.S2_D1), S07_PCIe_Connector (J700.A21)
GTH_DP1_M2C_N: S06_SOM2_C_D (J300.S2_C8), S07_PCIe_Connector (C705.2)
GTH_DP1_M2C_P: S06_SOM2_C_D (J300.S2_C7), S07_PCIe_Connector (C704.2)
GTH_DP2_C2M_N: S05_SOM2_A_B (J300.S2_B2), S07_PCIe_Connector (J700.A26)
GTH_DP2_C2M_P: S05_SOM2_A_B (J300.S2_B1), S07_PCIe_Connector (J700.A25)
GTH_DP2_M2C_N: S05_SOM2_A_B (J300.S2_B6), S07_PCIe_Connector (C707.2)
GTH_DP2_M2C_P: S05_SOM2_A_B (J300.S2_B5), S07_PCIe_Connector (C706.2)
GTH_DP3_C2M_N: S06_SOM2_C_D (J300.S2_D6), S07_PCIe_Connector (J700.A30)
GTH_DP3_C2M_P: S06_SOM2_C_D (J300.S2_D5), S07_PCIe_Connector (J700.A29)
GTH_DP3_M2C_N: S05_SOM2_A_B (J300.S2_A4), S07_PCIe_Connector (C709.2)
GTH_DP3_M2C_P: S05_SOM2_A_B (J300.S2_A3), S07_PCIe_Connector (C708.2)
GTH_REFCLK0_C2M_N: S06_SOM2_C_D (J300.S2_C4), S12_Clocks (R1207.2)
GTH_REFCLK0_C2M_P: S06_SOM2_C_D (J300.S2_C3), S12_Clocks (R1206.2)
GTH_REFCLK0_EN: S03_SOM1_A_B (J300.S1_B37), S12_Clocks (Q1201.1)
GTH_REFCLK0_N: S07_PCIe_Connector (J700.A14), S12_Clocks (R1205.2)
GTH_REFCLK0_P: S07_PCIe_Connector (J700.A13), S12_Clocks (R1203.2)
GTR_DP0_M2C_N: S03_SOM1_A_B (J300.S1_B58), S08_DisplayPort (C806.1)
GTR_DP0_M2C_P: S03_SOM1_A_B (J300.S1_B57), S08_DisplayPort (C803.1)
GTR_DP1_M2C_N: S03_SOM1_A_B (J300.S1_A48), S08_DisplayPort (C808.1)
GTR_DP1_M2C_P: S03_SOM1_A_B (J300.S1_A47), S08_DisplayPort (C807.1)
GTR_REFCLK1_C2M_N: S03_SOM1_A_B (J300.S1_B50), S12_Clocks (R1202.2)
GTR_REFCLK1_C2M_P: S03_SOM1_A_B (J300.S1_B49), S12_Clocks (R1201.2)
GTR_REFCLK1_EN: S03_SOM1_A_B (J300.S1_B36), S12_Clocks (Q1200.1)
JTAG_TCK_C2M: S03_SOM1_A_B (J300.S1_A25), S09_Connectors (D902.K J901.4 R901.2)
JTAG_TDI_C2M: S03_SOM1_A_B (J300.S1_A24), S09_Connectors (D905.K J901.8 R903.2)
JTAG_TDO_M2C: S03_SOM1_A_B (J300.S1_A23), S09_Connectors (D904.K J901.6 R902.2)
JTAG_TMS_C2M: S03_SOM1_A_B (J300.S1_A22), S09_Connectors (D901.K J901.2 R900.2)
NetJ300_S1_D24: S04_SOM1_C_D (J300.S1_D24), S11_LEDs (Q1106.1)
NetJ300_S1_D25: S04_SOM1_C_D (J300.S1_D25), S11_LEDs (Q1107.1)
NetJ300_S1_D26: S04_SOM1_C_D (J300.S1_D26), S11_LEDs (Q1108.1)
PCIE_PERSTN0_1V8: S05_SOM2_A_B (J300.S2_A26), S07_PCIe_Connector (U700.3)
PS_ERROR_OUT: S03_SOM1_A_B (J300.S1_B24), S11_LEDs (Q1100.1 R1102.2)
PS_ERROR_STATUS: S03_SOM1_A_B (J300.S1_B25), S11_LEDs (Q1101.1 R1103.2)
PS_POR_L_1V8: S04_SOM1_C_D (J300.S1_C15), S10_Reset_Logic (U1000.4)
PS_SRST_C2M_L: S04_SOM1_C_D (C402.1 J300.S1_C16 J401.1), S09_Connectors (D906.K J901.10)
PWROFF_L: S03_SOM1_A_B (J300.S1_B26 R305.2), S11_LEDs (Q1109.1)

## Assembly variants
DEFAULT: not fitted C238 C239 C240 C241 C? C? C? C? R700 R700 R? R? R? R? R? R? R? R?